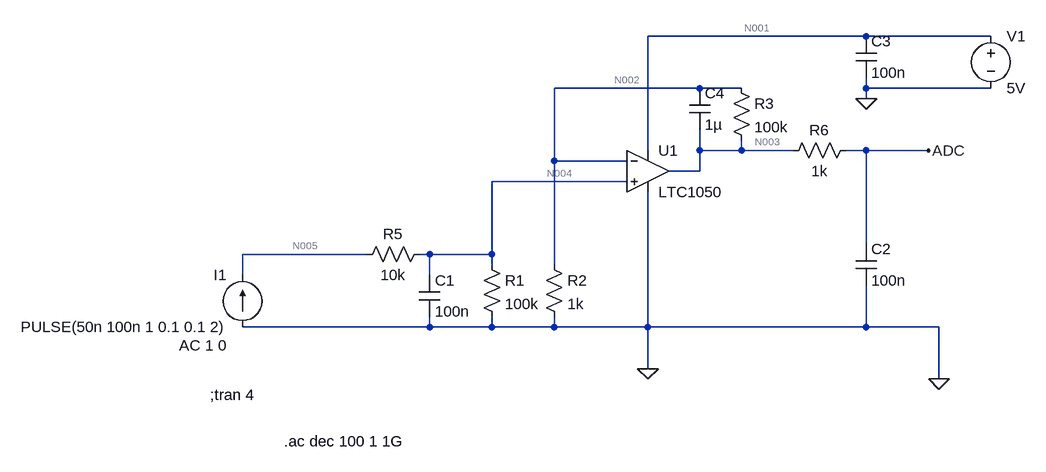
[diagram p0: schematic ampli transimpedance.asc]
ampli transimpedance.asc, the LTspice schematic file:
Version 4
SHEET 1 1224 680
WIRE 976 -288 640 -288
WIRE 1168 -288 976 -288
WIRE 720 -208 496 -208
WIRE 784 -208 720 -208
WIRE 976 -208 976 -224
WIRE 1168 -208 976 -208
WIRE 976 -192 976 -208
WIRE 640 -112 640 -288
WIRE 720 -112 720 -144
WIRE 784 -112 784 -128
WIRE 784 -112 720 -112
WIRE 864 -112 784 -112
WIRE 976 -112 944 -112
WIRE 1072 -112 976 -112
WIRE 496 -96 496 -208
WIRE 608 -96 496 -96
WIRE 720 -80 720 -112
WIRE 720 -80 672 -80
WIRE 608 -64 400 -64
WIRE 976 32 976 -112
WIRE 208 48 16 48
WIRE 304 48 288 48
WIRE 400 48 400 -64
WIRE 400 48 304 48
WIRE 400 64 400 48
WIRE 496 64 496 -96
WIRE 16 80 16 48
WIRE 304 80 304 48
WIRE 304 160 304 144
WIRE 304 160 16 160
WIRE 400 160 400 144
WIRE 400 160 304 160
WIRE 496 160 496 144
WIRE 496 160 400 160
WIRE 640 160 640 -48
WIRE 640 160 496 160
WIRE 976 160 976 96
WIRE 976 160 640 160
WIRE 1088 160 976 160
WIRE 640 224 640 160
WIRE 1088 240 1088 160
FLAG 640 224 0
FLAG 1088 240 0
FLAG 976 -192 0
FLAG 1072 -112 ADC
SYMBOL current 16 160 R180
WINDOW 0 24 80 Left 2
WINDOW 3 24 0 Left 2
WINDOW 123 24 -28 Left 2
WINDOW 39 0 0 Left 0
SYMATTR InstName I1
SYMATTR Value PULSE(50n 100n 1 0.1 0.1 2)
SYMATTR Value2 AC 1 0
SYMBOL res 304 32 R90
WINDOW 0 0 56 VBottom 2
WINDOW 3 32 56 VTop 2
SYMATTR InstName R5
SYMATTR Value 10k
SYMBOL cap 288 80 R0
SYMATTR InstName C1
SYMATTR Value 100n
SYMBOL res 384 48 R0
SYMATTR InstName R1
SYMATTR Value 100k
SYMBOL res 480 48 R0
SYMATTR InstName R2
SYMATTR Value 1k
SYMBOL res 848 -96 R270
WINDOW 0 32 56 VTop 2
WINDOW 3 0 56 VBottom 2
SYMATTR InstName R6
SYMATTR Value 1k
SYMBOL res 768 -224 R0
SYMATTR InstName R3
SYMATTR Value 100k
SYMBOL cap 704 -208 R0
SYMATTR InstName C4
SYMATTR Value 1µ
SYMBOL cap 960 32 R0
SYMATTR InstName C2
SYMATTR Value 100n
SYMBOL cap 960 -288 R0
SYMATTR InstName C3
SYMATTR Value 100n
SYMBOL voltage 1168 -304 R0
WINDOW 123 0 0 Left 0
WINDOW 39 0 0 Left 0
SYMATTR InstName V1
SYMATTR Value 5V
SYMBOL OpAmps\\LTC1050 640 -144 R0
SYMATTR InstName U1
TEXT -34 264 Left 2 !;tran 4
TEXT 80 336 Left 2 !.ac dec 100 1 1G

The netlist it stands for:
* ampli transimpedance.asc
I1 0 N005 PULSE(50n 100n 1 0.1 0.1 2) AC 1 0
R5 N004 N005 10k
C1 N004 0 100n
R1 N004 0 100k
R2 N002 0 1k
R6 N003 ADC 1k
R3 N002 N003 100k
C4 N002 N003 1µ
C2 ADC 0 100n
C3 N001 0 100n
V1 N001 0 5V
XU1 N004 N002 N001 0 N003 LTC1050  ; pins In+ In- V+ V- OUT
;tran 4
.ac dec 100 1 1G
.lib LTC.lib
.backanno
.end

* Results of the author's LTspice run, read from the files saved beside the schematic
* Operating Point, zero values left out:
*   V(n005) = 5.5 mV
*   V(n004) = 5 mV
*   V(n002) = 5 mV
*   V(n003) = 505 mV
*   V(adc) = 505 mV
*   V(n001) = 5 V
*   I(I1) = 50 nA
*   I(R5) = -50 nA
*   I(R1) = 50 nA
*   I(R2) = 5 µA
*   I(R3) = -5 µA
*   I(V1) = -754.1 µA
*   Ix(u1:3) = 754.1 µA
*   Ix(u1:4) = -749.1 µA
*   Ix(u1:5) = -5 µA
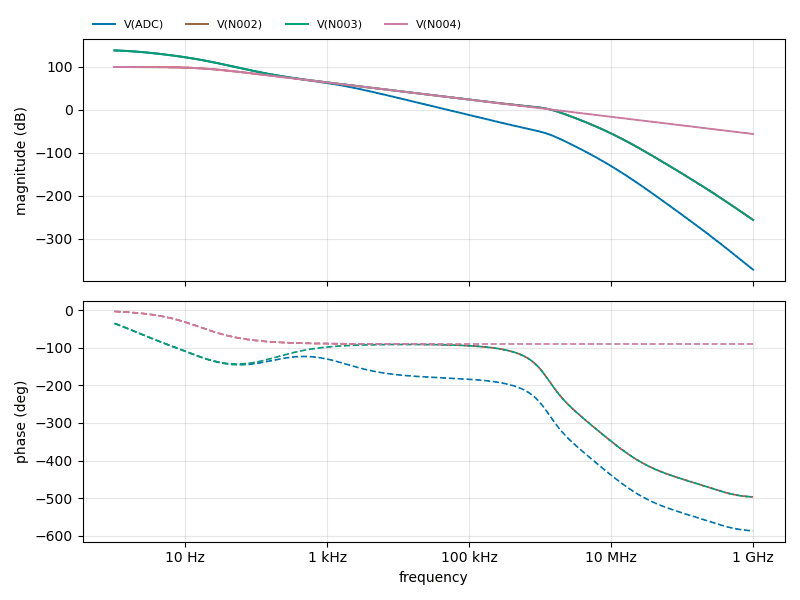
[diagram p1: AC Analysis of ampli transimpedance.asc, plotted from the saved traces]
* AC Analysis, 1 run:
*   V(ADC): 138.62 dB at 1 Hz, -371.90 dB at 1 GHz, peak 138.62 dB at 1 Hz, 3 dB below the peak at 2.107 Hz
*   V(N002): 99.98 dB at 1 Hz, -255.94 dB at 1 GHz, peak 99.98 dB at 1 Hz, 3 dB below the peak at 15.97 Hz
*   V(N003): 138.62 dB at 1 Hz, -255.94 dB at 1 GHz, peak 138.62 dB at 1 Hz, 3 dB below the peak at 2.107 Hz
*   V(N004): 99.98 dB at 1 Hz, -55.96 dB at 1 GHz, peak 99.98 dB at 1 Hz, 3 dB below the peak at 15.98 Hz